# EAGLE schematic custom65 (EAGLE 9.3.1)
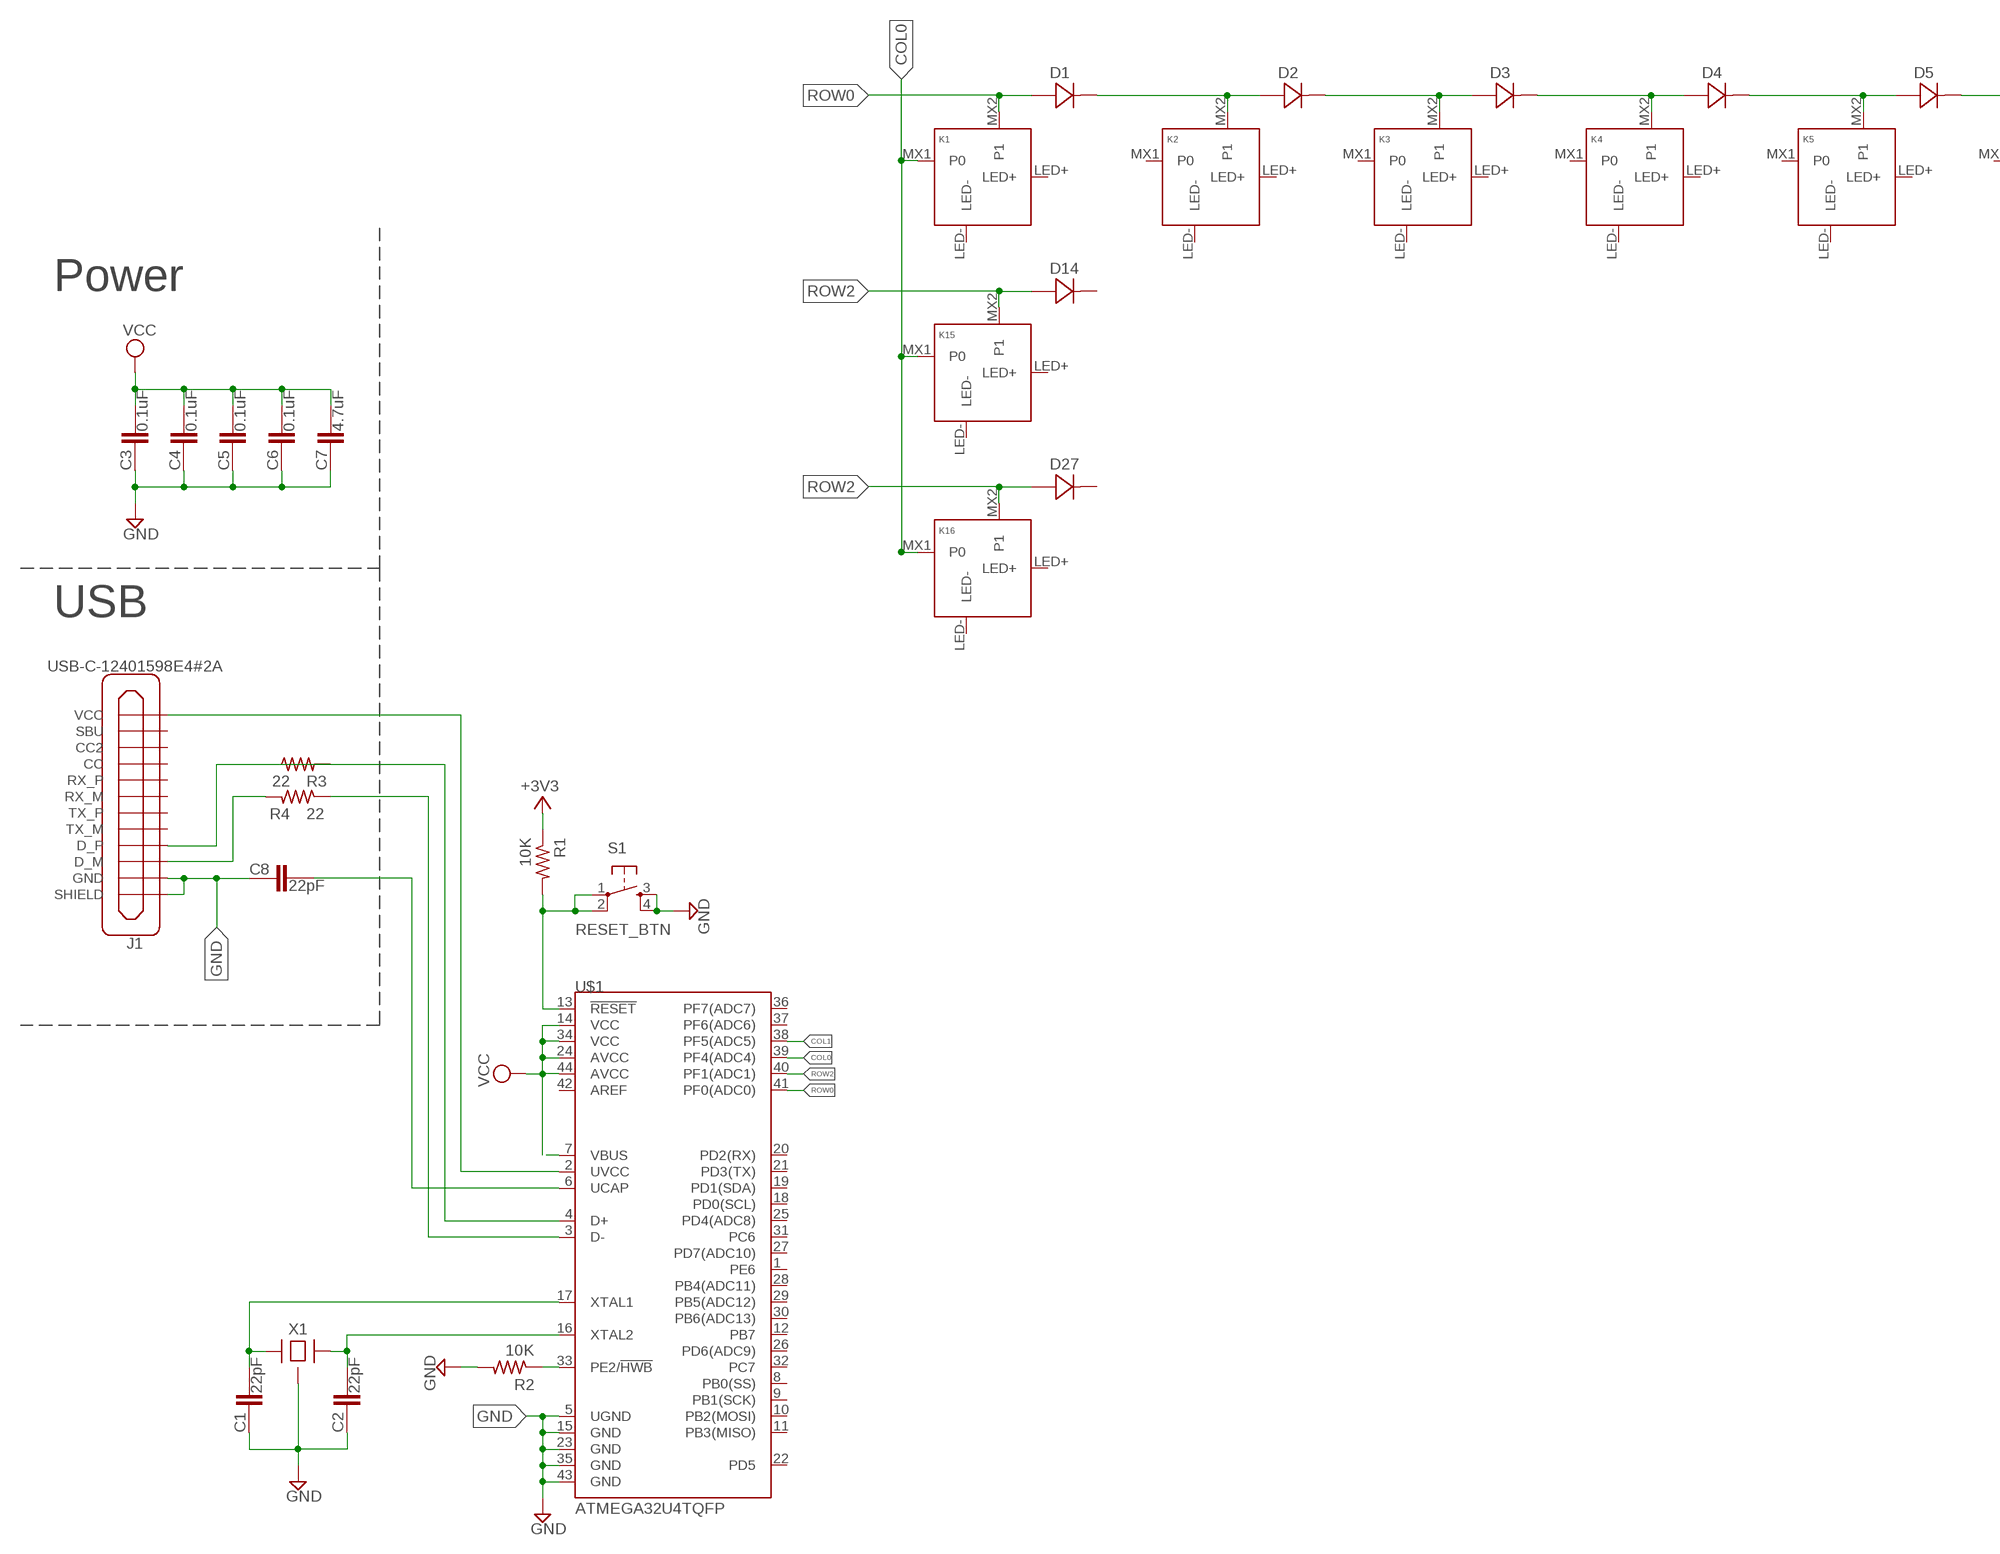
[diagram p0: schematic, sheet 1, part 1 of 2]
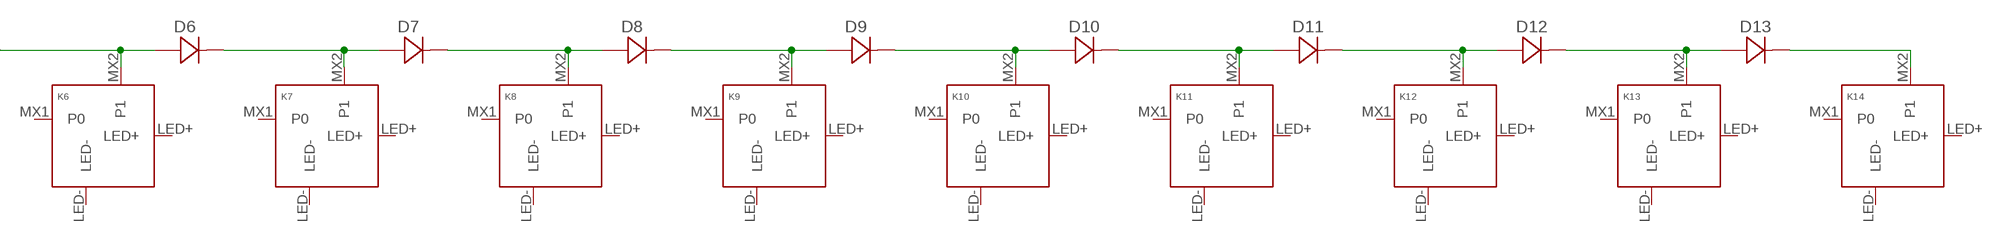
[diagram p1: schematic, sheet 1, part 2 of 2]

## Parts
C1  22pF  CAPACITOR-0603  [C0603]
C2  22pF  CAPACITOR-0603  [C0603]
C3  0.1uF  CAPACITOR-0603  [C0603]
C4  0.1uF  CAPACITOR-0603  [C0603]
C5  0.1uF  CAPACITOR-0603  [C0603]
C6  0.1uF  CAPACITOR-0603  [C0603]
C7  4.7uF  CAPACITOR-0603  [C0603]
C8  22pF  CAPACITOR-0603  [C0603]
D1  DIODE-DFN0603-2  [DFN0603-2]
D2  DIODE-DFN0603-2  [DFN0603-2]
D3  DIODE-DFN0603-2  [DFN0603-2]
D4  DIODE-DFN0603-2  [DFN0603-2]
D5  DIODE-DFN0603-2  [DFN0603-2]
D6  DIODE-DFN0603-2  [DFN0603-2]
D7  DIODE-DFN0603-2  [DFN0603-2]
D8  DIODE-DFN0603-2  [DFN0603-2]
D9  DIODE-DFN0603-2  [DFN0603-2]
D10  DIODE-DFN0603-2  [DFN0603-2]
D11  DIODE-DFN0603-2  [DFN0603-2]
D12  DIODE-DFN0603-2  [DFN0603-2]
D13  DIODE-DFN0603-2  [DFN0603-2]
D14  DIODE-DFN0603-2  [DFN0603-2]
D27  DIODE-DFN0603-2  [DFN0603-2]
J1  USB-C-12401598E4#2A  [12401598E4#2A]
K1  KEYSWITCH-LEDTHTHOLE-MXHS-1U-LEDTHTHOLE  [MXHS-1U-LEDTHTHOLE]
K2  KEYSWITCH-LEDTHTHOLE-MXHS-1U-LEDTHTHOLE  [MXHS-1U-LEDTHTHOLE]
K3  KEYSWITCH-LEDTHTHOLE-MXHS-1U-LEDTHTHOLE  [MXHS-1U-LEDTHTHOLE]
K4  KEYSWITCH-LEDTHTHOLE-MXHS-1U-LEDTHTHOLE  [MXHS-1U-LEDTHTHOLE]
K5  KEYSWITCH-LEDTHTHOLE-MXHS-1U-LEDTHTHOLE  [MXHS-1U-LEDTHTHOLE]
K6  KEYSWITCH-LEDTHTHOLE-MXHS-1U-LEDTHTHOLE  [MXHS-1U-LEDTHTHOLE]
K7  KEYSWITCH-LEDTHTHOLE-MXHS-1U-LEDTHTHOLE  [MXHS-1U-LEDTHTHOLE]
K8  KEYSWITCH-LEDTHTHOLE-MXHS-1U-LEDTHTHOLE  [MXHS-1U-LEDTHTHOLE]
K9  KEYSWITCH-LEDTHTHOLE-MXHS-1U-LEDTHTHOLE  [MXHS-1U-LEDTHTHOLE]
K10  KEYSWITCH-LEDTHTHOLE-MXHS-1U-LEDTHTHOLE  [MXHS-1U-LEDTHTHOLE]
K11  KEYSWITCH-LEDTHTHOLE-MXHS-1U-LEDTHTHOLE  [MXHS-1U-LEDTHTHOLE]
K12  KEYSWITCH-LEDTHTHOLE-MXHS-1U-LEDTHTHOLE  [MXHS-1U-LEDTHTHOLE]
K13  KEYSWITCH-LEDTHTHOLE-MXHS-1U-LEDTHTHOLE  [MXHS-1U-LEDTHTHOLE]
K14  KEYSWITCH-LEDTHTHOLE-MXHS-1U-LEDTHTHOLE  [MXHS-1U-LEDTHTHOLE]
K15  KEYSWITCH-LEDTHTHOLE-MXHS-1U-LEDTHTHOLE  [MXHS-1U-LEDTHTHOLE]
K16  KEYSWITCH-LEDTHTHOLE-MXHS-1U-LEDTHTHOLE  [MXHS-1U-LEDTHTHOLE]
R1  10K  R-US_R0603  [R0603]
R2  10K  R-US_R0603  [R0603]
R3  22  R-US_R0603  [R0603]
R4  22  R-US_R0603  [R0603]
S1  RESET_BTN  TAC_SWITCHSMD  [TACTILE-SWITCH-SMD]
U$1  ATMEGA32U4TQFP  [SPARKFUN-DIGITALIC_TQFP44]
X1  CRYSTAL-4PIN-3.2X2.5  [CRYSTAL-3.2X2.5]

## Nets
+3V3: R1.1
COL0: K1.MX1(P0) K15.MX1(P0) K16.MX1(P0) U$1.39(PF4(ADC4))
COL1: U$1.38(PF5(ADC5))
GND: C1.1 C2.1 C3.1 C4.1 C5.1 C6.1 C7.1 C8.1 J1.A1(GND) J1.A12(GND) J1.B1(GND) J1.B12(GND) J1.SHIELD@1(SHIELD) J1.SHIELD@2(SHIELD) J1.SHIELD@3(SHIELD) J1.SHIELD@4(SHIELD) R2.2 S1.3 S1.4 U$1.5(UGND) U$1.15(GND) U$1.23(GND) U$1.35(GND) U$1.43(GND) X1.2(GND) X1.4(GND)
N$1: C1.2 U$1.17(XTAL1) X1.1
N$2: C2.2 U$1.16(XTAL2) X1.3
N$3: R1.2 S1.1 S1.2 U$1.13(!RESET)
N$4: R2.1 U$1.33(PE2/!HWB)
N$5: C8.2 U$1.6(UCAP)
N$6: J1.A4(VCC) J1.A9(VCC) J1.B4(VCC) J1.B9(VCC) U$1.2(UVCC)
N$7: J1.A6(D_P) J1.B6(D_P) R3.2
N$8: R3.1 U$1.4(D+)
N$9: R4.1 U$1.3(D-)
N$10: J1.A7(D_M) J1.B7(D_M) R4.2
N$11: D2.C D3.A K3.MX2(P1)
N$12: D3.C D4.A K4.MX2(P1)
N$13: D1.C D2.A K2.MX2(P1)
N$14: D4.C D5.A K5.MX2(P1)
N$15: D5.C D6.A K6.MX2(P1)
N$16: D6.C D7.A K7.MX2(P1)
N$17: D7.C D8.A K8.MX2(P1)
N$18: D8.C D9.A K9.MX2(P1)
N$20: D9.C D10.A K10.MX2(P1)
N$21: D10.C D11.A K11.MX2(P1)
N$22: D11.C D12.A K12.MX2(P1)
N$23: D12.C D13.A K13.MX2(P1)
N$24: D13.C K14.MX2(P1)
ROW0: D1.A K1.MX2(P1) U$1.41(PF0(ADC0))
ROW2: D14.A D27.A K15.MX2(P1) K16.MX2(P1) U$1.40(PF1(ADC1))
VCC: C3.2 C4.2 C5.2 C6.2 C7.2 U$1.7(VBUS) U$1.14(VCC) U$1.24(AVCC) U$1.34(VCC) U$1.44(AVCC)
Unconnected: D14.C D27.C J1.A2(TX_P) J1.A3(TX_M) J1.A5(CC) J1.A8(SBU) J1.A10(RX_M) J1.A11(RX_P) J1.B2(TX_P) J1.B3(TX_M) J1.B5(CC2) J1.B8(SBU) J1.B10(RX_M) J1.B11(RX_P) K1.LED+ K1.LED- K2.LED+ K2.LED- K2.MX1(P0) K3.LED+ K3.LED- K3.MX1(P0) K4.LED+ K4.LED- K4.MX1(P0) K5.LED+ K5.LED- K5.MX1(P0) K6.LED+ K6.LED- K6.MX1(P0) K7.LED+ K7.LED- K7.MX1(P0) K8.LED+ K8.LED- K8.MX1(P0) K9.LED+ K9.LED- K9.MX1(P0) K10.LED+ K10.LED- K10.MX1(P0) K11.LED+ K11.LED- K11.MX1(P0) K12.LED+ K12.LED- K12.MX1(P0) K13.LED+ K13.LED- K13.MX1(P0) K14.LED+ K14.LED- K14.MX1(P0) K15.LED+ K15.LED- K16.LED+ K16.LED- U$1.1(PE6) U$1.8(PB0(SS)) U$1.9(PB1(SCK)) U$1.10(PB2(MOSI)) U$1.11(PB3(MISO)) U$1.12(PB7) U$1.18(PD0(SCL)) U$1.19(PD1(SDA)) U$1.20(PD2(RX)) U$1.21(PD3(TX)) U$1.22(PD5) U$1.25(PD4(ADC8)) U$1.26(PD6(ADC9)) U$1.27(PD7(ADC10)) U$1.28(PB4(ADC11)) U$1.29(PB5(ADC12)) U$1.30(PB6(ADC13)) U$1.31(PC6) U$1.32(PC7) U$1.36(PF7(ADC7)) U$1.37(PF6(ADC6)) U$1.42(AREF)

## Notes on the sheet
- Power
- USB

## Library data of the parts
C1-C8 = Components:CAPACITOR
D1-D14 D27 = Components:DIODE: Standard 1N4148 diode
J1 = USB:USB-C
K1-K16 = Keyboard:KEYSWITCH-LEDTHTHOLE
R1-R4 = rcl:R-US_: RESISTOR, American symbol; SPICEPREFIX: R
S1 = SparkFun-Retired:TAC_SWITCH: Momentary Switch Button commonly used for reset or general input. Spark Fun Electronics SKU : COM-00097 SMT- SWCH-08247; PROD_ID: SWCH-08247; VALUE: TAC_SWITCHSMD
U$1 = SparkFun-Retired:ATMEGA32U4: Atmel 44-pin 8-bit Microcontroller with 32KBytes of ISP Flash and USB Controller ----- Please use the QFN-44-NOPAD_1:1 package for the footprint of all boards using a 32U4. Route traces directly away from the pads as much as possible.; PROD_ID: IC-11161
X1 = Components:CRYSTAL-4PIN